# Altium schematic sheet ad.SchDoc
size A3
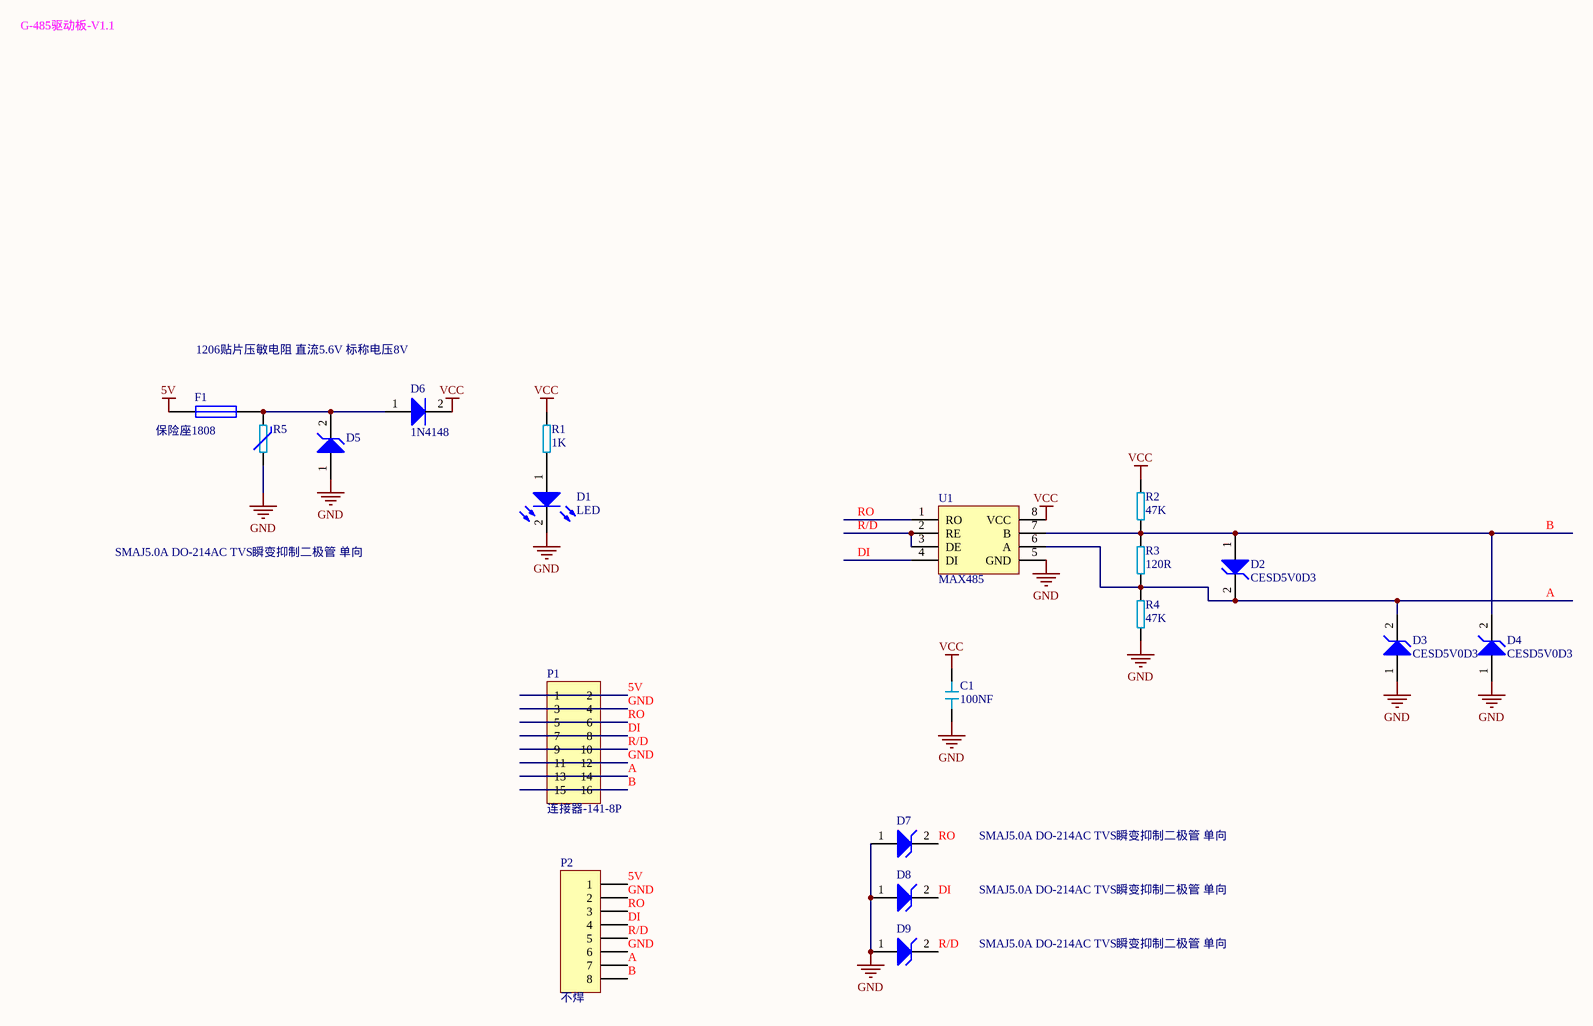
[diagram p0: ad.SchDoc]

## Parts
C1  100NF  [C0603]
D1  LED  [LED0603]
D2  CESD5V0D3  [SOD323]
D3  CESD5V0D3  [SOD323]
D4  CESD5V0D3  [SOD323]
D5  SMAJ5.0A DO-214AC TVS瞬变抑制二极管 单向  [SMA]
D6  1N4148  [SOD123]
D7  SMAJ5.0A DO-214AC TVS瞬变抑制二极管 单向  [SMA]
D8  SMAJ5.0A DO-214AC TVS瞬变抑制二极管 单向  [SMA]
D9  SMAJ5.0A DO-214AC TVS瞬变抑制二极管 单向  [SMA]
F1  保险座1808  [F1808-ZUO]
P1  连接器-141-8P  [141V-8P]
P2  不焊  [SIP8]
R1  1K  [R0603]
R2  47K  [R0603]
R3  120R  [R0603]
R4  47K  [R0603]
R5  1206贴片压敏电阻 直流5.6V 标称电压8V  [R1206]
U1  MAX485  [SO8]

## Nets
5V: F1.1 P1.1 P1.2 P2.1
GND: C1.1 D1.2(K) D3.1 D4.1 D5.1 D7.1 D8.1 D9.1 P1.3 P1.4 P1.11 P1.12 P2.2 P2.6 R4.1 R5.1 U1.5(GND)
VCC: C1.2 D6.2(K) R1.2 R2.2 U1.8(VCC)
A: D2.2 D3.2 P1.13 P1.14 P2.7 R3.1 R4.2 U1.6(A)
B: D2.1 D4.2 P1.15 P1.16 P2.8 R2.1 R3.2 U1.7(B)
DI: D8.2 P1.7 P1.8 P2.4 U1.4(DI)
R/D: D9.2 P1.9 P1.10 P2.5 U1.2(RE) U1.3(DE)
RO: D7.2 P1.5 P1.6 P2.3 U1.1(RO)
NetD1_1: D1.1(A) R1.1
NetD5_2: D5.2 D6.1(A) F1.2 R5.2

## Notes on the sheet
- Labels drawn without touching a wire or pin: G-485驱动板-V1.1

## Library data of the parts
C1 = C0603: 贴片电容
D1 = LED0603: Published: 8-Jun-2000; LatestRevisionDate: 08-Jul-2005; LatestRevisionNote: Mech Layer 1 removed.; PackageReference: LED-0; Publisher: Altium Limited; PackageDescription: LED; 2 Leads
D2-D5 D7-D9 = TVS-SMA: 稳压管; Published: 8-Jun-2000; LatestRevisionDate: 17-Jul-2002; LatestRevisionNote: Re-released for DXP Platform.; DatasheetVersion: 1997; PackageReference: DO-35; Publisher: Altium Limited; PackageDescription: Diode, Axial; Body 3.8 x 1.9 mm (LxDia. max), Lead Dia. 0.53 mm (max); Code_JEDEC: DO-204-AH; ComponentLink1Description: Manufacturer Link; ComponentLink1URL: http://www.fairchildsemi.com/; ComponentLink2Description: Datasheet; ComponentLink2URL: http://www.fairchildsemi.com/ds/1N%2F1N4448.pdf
D6 = DD: 二极管; Published: 8-Jun-2000; LatestRevisionDate: 17-Jul-2002; LatestRevisionNote: Re-released for DXP Platform.; DatasheetVersion: 1997; PackageReference: DO-35; Publisher: Altium Limited; PackageDescription: Diode, Axial; Body 3.8 x 1.9 mm (LxDia. max), Lead Dia. 0.53 mm (max); Code_JEDEC: DO-204-AH; ComponentLink1Description: Manufacturer Link; ComponentLink1URL: http://www.fairchildsemi.com/; ComponentLink2Description: Datasheet; ComponentLink2URL: http://www.fairchildsemi.com/ds/1N%2F1N4448.pdf
F1 = Fuse0805: 自恢复保险; Published: 8-Jun-2000; LatestRevisionDate: 17-Jul-2002; LatestRevisionNote: Re-released for DXP Platform.; PackageReference: PIN-W2/E2.8; Publisher: Altium Limited; PackageDescription: Thru-Hole; 2 Leads
P1 = DIC16: 连接器; LatestRevisionDate: 17-Jul-2002; LatestRevisionNote: Re-released for DXP Platform.; Publisher: Altium Limited
P2 = SIP8: 连接器; LatestRevisionDate: 17-Jul-2002; LatestRevisionNote: Re-released for DXP Platform.; Publisher: Altium Limited
R1-R4 = R-0603: 贴片电阻
R5 = RV: 压敏电阻